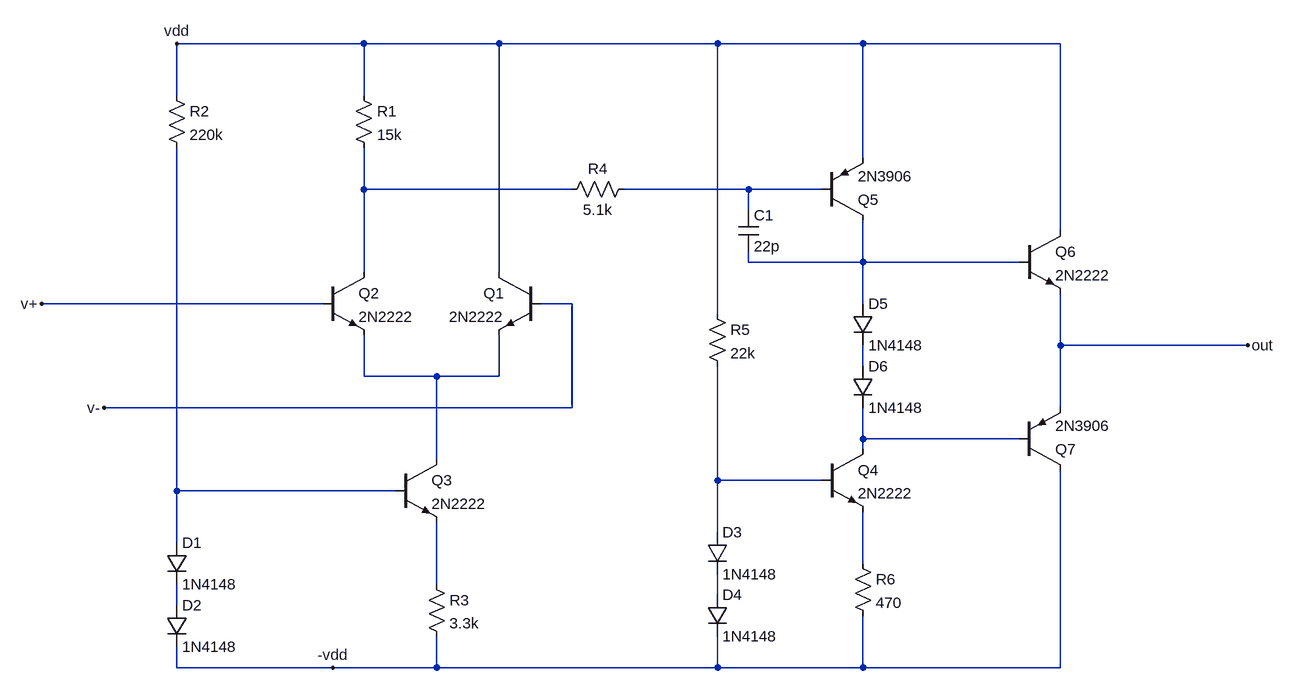
[diagram p0: schematic op_basic.asc]
op_basic.asc, the LTspice schematic file:
Version 4
SHEET 1 1488 1116
WIRE -496 -240 -784 -240
WIRE -288 -240 -496 -240
WIRE 48 -240 -288 -240
WIRE 272 -240 48 -240
WIRE 576 -240 272 -240
WIRE -784 -160 -784 -240
WIRE -496 -160 -496 -240
WIRE 272 -64 272 -240
WIRE -496 -16 -496 -80
WIRE -176 -16 -496 -16
WIRE 96 -16 -96 -16
WIRE 208 -16 96 -16
WIRE 96 16 96 -16
WIRE 576 48 576 -240
WIRE 96 96 96 80
WIRE 272 96 272 32
WIRE 272 96 96 96
WIRE 512 96 272 96
WIRE -496 112 -496 -16
WIRE -288 112 -288 -240
WIRE -560 160 -992 160
WIRE -176 160 -224 160
WIRE 272 160 272 96
WIRE 48 176 48 -240
WIRE 576 224 576 144
WIRE 864 224 576 224
WIRE 272 256 272 224
WIRE -496 272 -496 208
WIRE -384 272 -496 272
WIRE -288 272 -288 208
WIRE -288 272 -384 272
WIRE -176 320 -176 160
WIRE -176 320 -896 320
WIRE 576 320 576 224
WIRE 272 368 272 320
WIRE 512 368 272 368
WIRE 272 384 272 368
WIRE -384 400 -384 272
WIRE 48 432 48 256
WIRE 208 432 48 432
WIRE -784 448 -784 -80
WIRE -448 448 -784 448
WIRE 48 512 48 432
WIRE -784 528 -784 448
WIRE 272 560 272 480
WIRE -384 592 -384 496
WIRE 48 608 48 576
WIRE -784 624 -784 592
WIRE -784 720 -784 688
WIRE -544 720 -784 720
WIRE -384 720 -384 672
WIRE -384 720 -544 720
WIRE 48 720 48 672
WIRE 48 720 -384 720
WIRE 272 720 272 640
WIRE 272 720 48 720
WIRE 576 720 576 416
WIRE 576 720 272 720
FLAG 864 224 out
FLAG -784 -240 vdd
FLAG -544 720 -vdd
FLAG -992 160 v+
FLAG -896 320 v-
SYMBOL res -512 -176 R0
SYMATTR InstName R1
SYMATTR Value 15k
SYMBOL npn -224 112 M0
SYMATTR InstName Q1
SYMATTR Value 2N2222
SYMBOL npn -560 112 R0
SYMATTR InstName Q2
SYMATTR Value 2N2222
SYMBOL npn -448 400 R0
SYMATTR InstName Q3
SYMATTR Value 2N2222
SYMBOL res -800 -176 R0
SYMATTR InstName R2
SYMATTR Value 220k
SYMBOL res -400 576 R0
SYMATTR InstName R3
SYMATTR Value 3.3k
SYMBOL diode -800 528 R0
SYMATTR InstName D1
SYMATTR Value 1N4148
SYMBOL diode -800 624 R0
SYMATTR InstName D2
SYMATTR Value 1N4148
SYMBOL res -80 -32 R90
WINDOW 0 0 56 VBottom 2
WINDOW 3 32 56 VTop 2
SYMATTR InstName R4
SYMATTR Value 5.1k
SYMBOL res 32 160 R0
SYMATTR InstName R5
SYMATTR Value 22k
SYMBOL diode 32 512 R0
SYMATTR InstName D3
SYMATTR Value 1N4148
SYMBOL diode 32 608 R0
SYMATTR InstName D4
SYMATTR Value 1N4148
SYMBOL res 256 544 R0
SYMATTR InstName R6
SYMATTR Value 470
SYMBOL npn 208 384 R0
SYMATTR InstName Q4
SYMATTR Value 2N2222
SYMBOL diode 256 160 R0
SYMATTR InstName D5
SYMATTR Value 1N4148
SYMBOL diode 256 256 R0
SYMATTR InstName D6
SYMATTR Value 1N4148
SYMBOL pnp 208 32 M180
SYMATTR InstName Q5
SYMATTR Value 2N3906
SYMBOL cap 80 16 R0
SYMATTR InstName C1
SYMATTR Value 22p
SYMBOL npn 512 48 R0
SYMATTR InstName Q6
SYMATTR Value 2N2222
SYMBOL pnp 512 416 M180
SYMATTR InstName Q7
SYMATTR Value 2N3906

The netlist it stands for:
* op_basic.asc
R1 vdd N001 15k
Q1 vdd v- N005 0 2N2222
Q2 N001 v+ N005 0 2N2222
Q3 N005 N008 N010 0 2N2222
R2 vdd N008 220k
R3 N010 -vdd 3.3k
D1 N008 N012 1N4148
D2 N012 -vdd 1N4148
R4 N002 N001 5.1k
R5 vdd N007 22k
D3 N007 N011 1N4148
D4 N011 -vdd 1N4148
R6 N009 -vdd 470
Q4 N006 N007 N009 0 2N2222
D5 N003 N004 1N4148
D6 N004 N006 1N4148
Q5 N003 N002 vdd 0 2N3906
C1 N002 N003 22p
Q6 vdd N003 out 0 2N2222
Q7 -vdd N006 out 0 2N3906
.model D D
.lib standard.dio
.model NPN NPN
.model PNP PNP
.lib standard.bjt
.backanno
.end